# Altium schematic sheet Power.SchDoc: xcore.ai Multi Channel Audio
size 408 x 287 mm; DocumentNumber: 8; Revision: 1V1; SheetNumber: 8; SheetTotal: 8
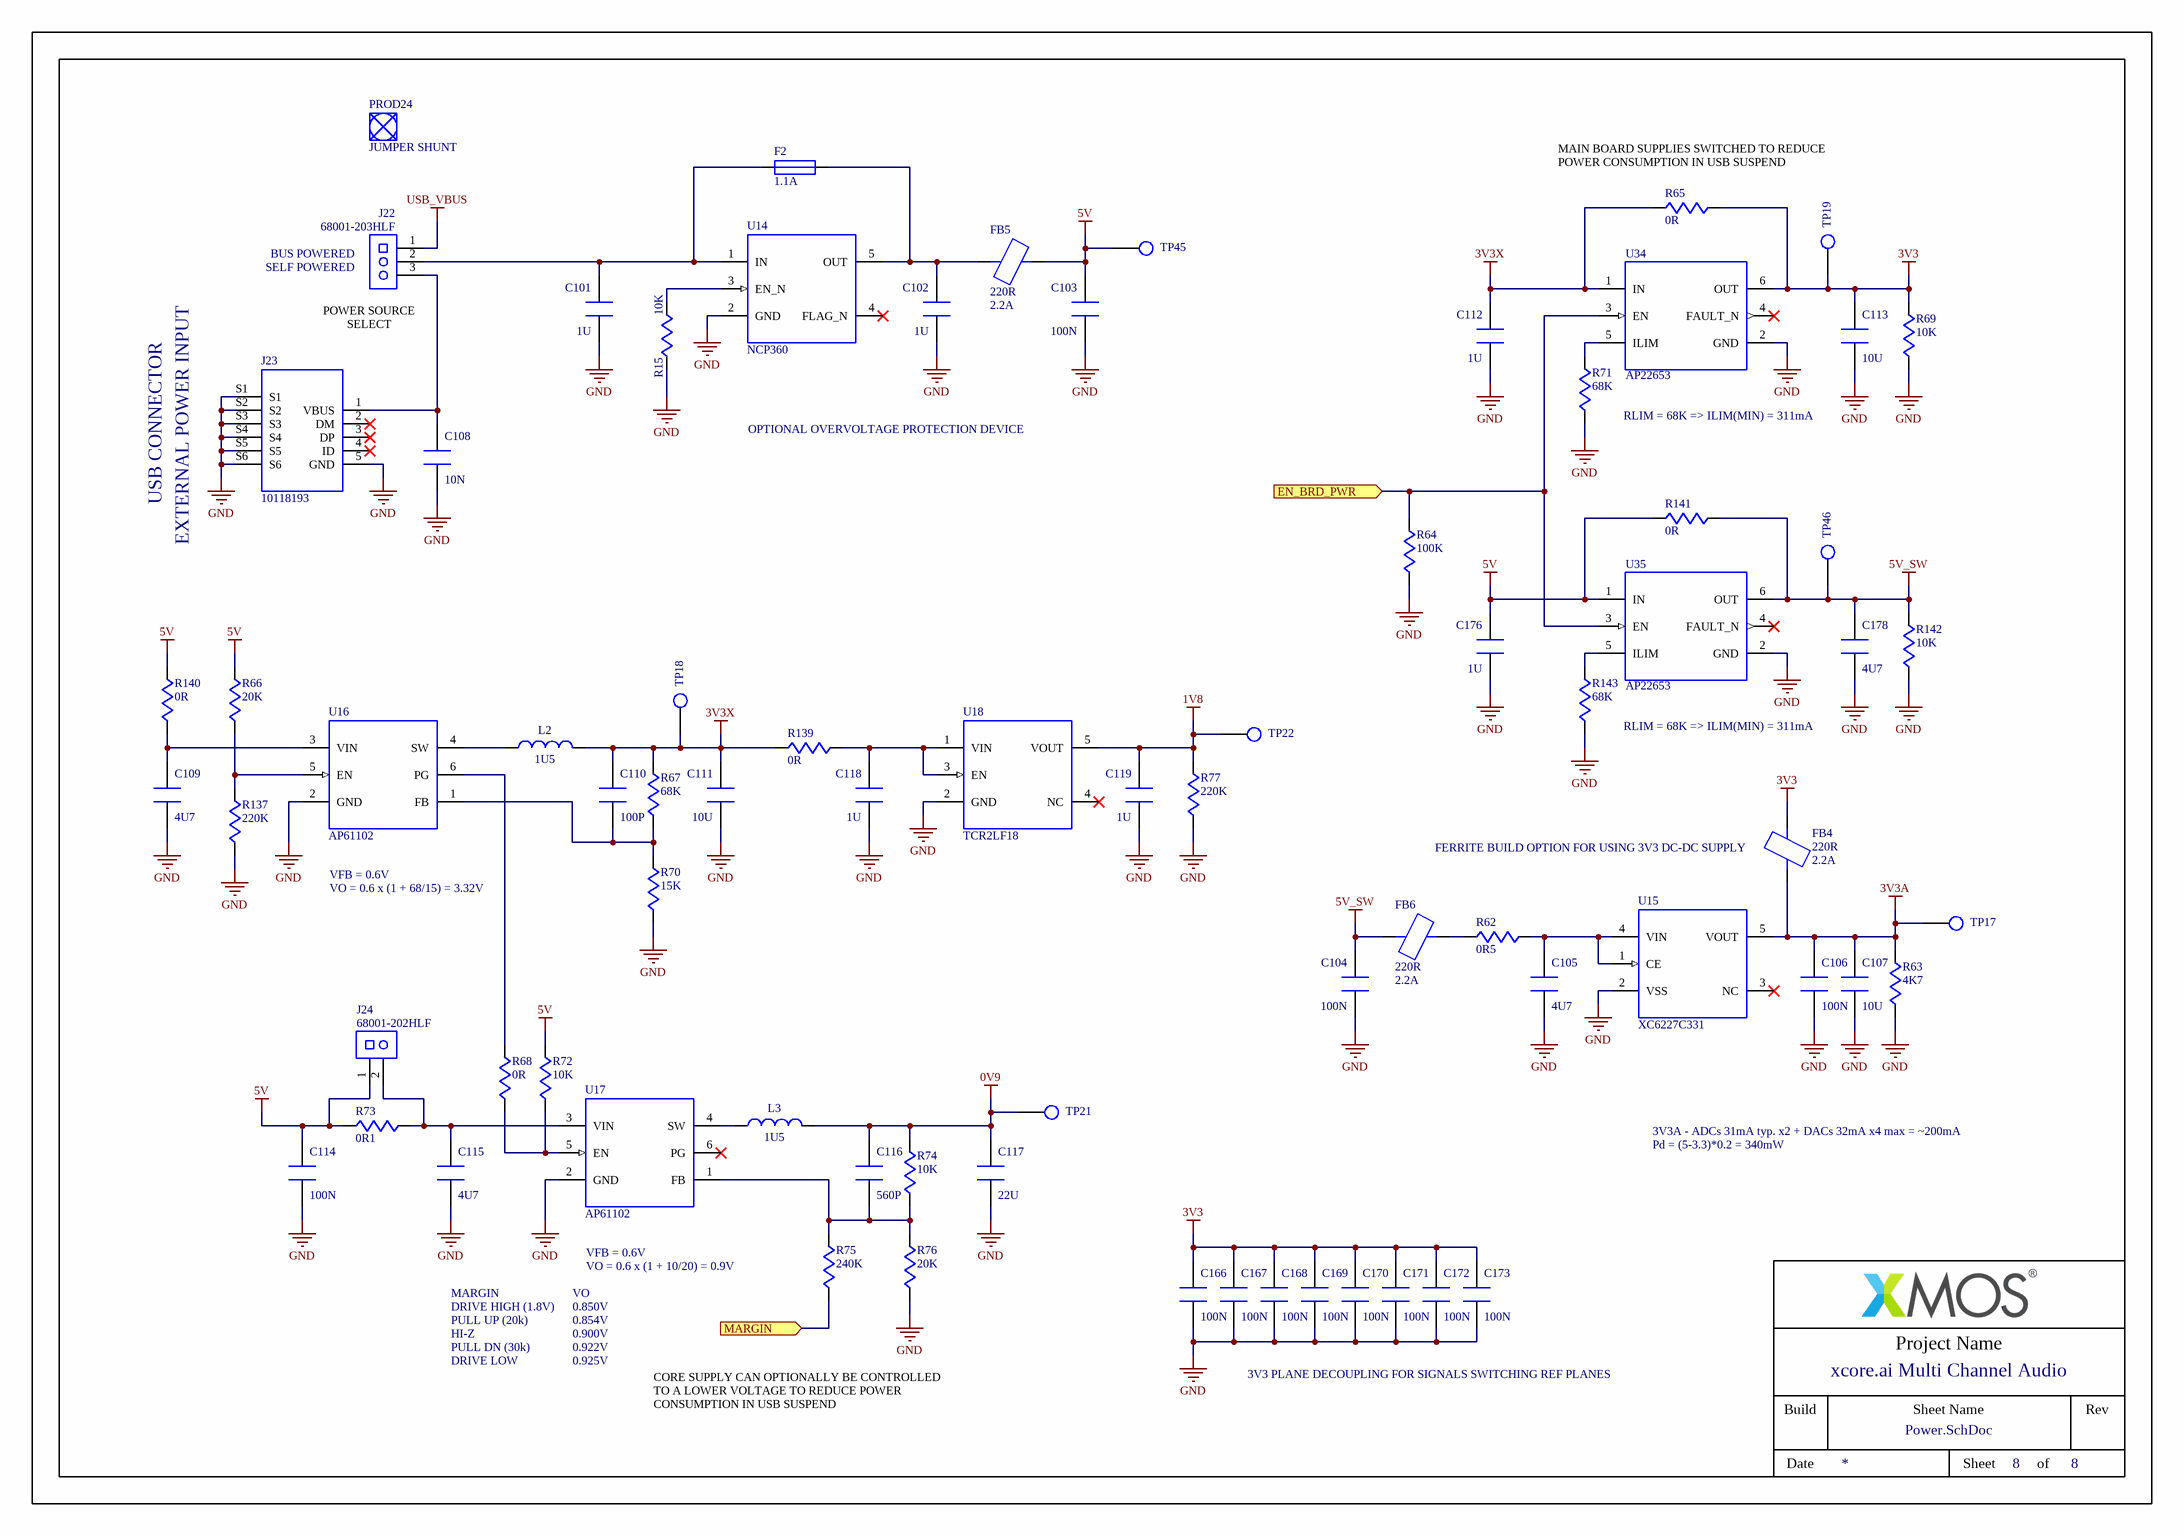
[diagram p0: Power.SchDoc]

## Parts
C101  1U  [CAPC1005X55N]
C102  1U  [CAPC1005X55N]
C103  100N  [CAPC1005X55N]
C104  100N  [CAPC1005X55N]
C105  4U7  [CAPC1608X90N]
C106  100N  [CAPC1005X55N]
C107  10U  [CAPC1608X90N]
C108  10N  [CAPC1005X55N]
C109  4U7  [CAPC1608X90N]
C110  100P  [CAPC1005X55N]
C111  10U  [CAPC1608X90N]
C112  1U  [CAPC1005X55N]
C113  10U  [CAPC1608X90N]
C114  100N  [CAPC1005X55N]
C115  4U7  [CAPC1608X90N]
C116  560P  [CAPC1005X55N]
C117  22U  [CAPC1608X90N]
C118  1U  [CAPC1005X55N]
C119  1U  [CAPC1005X55N]
C166  100N  [CAPC1005X55N]
C167  100N  [CAPC1005X55N]
C168  100N  [CAPC1005X55N]
C169  100N  [CAPC1005X55N]
C170  100N  [CAPC1005X55N]
C171  100N  [CAPC1005X55N]
C172  100N  [CAPC1005X55N]
C173  100N  [CAPC1005X55N]
C176  1U  [CAPC1005X55N]
C178  4U7  [CAPC1608X90N]
F2  1.1A  [FUSC4632X150N]
FB4  220R  Rated Current: 2.2A  [INDC1608X95N]
FB5  220R  Rated Current: 2.2A  [INDC1608X95N]
FB6  220R  Rated Current: 2.2A  [INDC1608X95N]
J22  68001-203HLF  [HDR_FCI_68001_203]
J23  10118193  [CON_FCI_10118193]
J24  68001-202HLF  [HDR_FCI_68001_202]
L2  1U5  [INDC2520X120N]
L3  1U5  [INDC2520X120N]
PROD24  JUMPER SHUNT  (mechanical)
R15  10K  [RESC1608X55N]
R62  0R5  [RESC1608X55N]
R63  4K7  [RESC1608X55N]
R64  100K  [RESC1608X55N]
R65  0R  [RESC1608X55N]
R66  20K  [RESC1608X55N]
R67  68K  [RESC1608X55N]
R68  0R  [RESC1608X55N]
R69  10K  [RESC1608X55N]
R70  15K  [RESC1608X55N]
R71  68K  [RESC1608X55N]
R72  10K  [RESC1608X55N]
R73  0R1  [RESC1608X55N]
R74  10K  [RESC1608X55N]
R75  240K  [RESC1608X55N]
R76  20K  [RESC1608X55N]
R77  220K  [RESC1608X55N]
R137  220K  [RESC1608X55N]
R139  0R  [RESC1608X55N]
R140  0R  [RESC1608X55N]
R141  0R  [RESC1608X55N]
R142  10K  [RESC1608X55N]
R143  68K  [RESC1608X55N]
TP17  TESTPOINT  [TESTPOINT_THRU]  (value not drawn)  (no BOM)
TP18  TESTPOINT  [TESTPOINT_THRU]  (value not drawn)  (no BOM)
TP19  TESTPOINT  [TESTPOINT_THRU]  (value not drawn)  (no BOM)
TP21  TESTPOINT  [TESTPOINT_THRU]  (value not drawn)  (no BOM)
TP22  TESTPOINT  [TESTPOINT_THRU]  (value not drawn)  (no BOM)
TP45  TESTPOINT  [TESTPOINT_THRU]  (value not drawn)  (no BOM)
TP46  TESTPOINT  [TESTPOINT_THRU]  (value not drawn)  (no BOM)
U14  NCP360  [SOT23-5P95_275X110L40X37N]
U15  XC6227C331  [TOREX_SOT_89_5]
U16  AP61102  [ICSOFL6P50_160X160X60L30X21N]
U17  AP61102  [ICSOFL6P50_160X160X60L30X21N]
U18  TCR2LF18  [SOT23-5P95_275X110L40X37N]
U34  AP22653  [SOT95P280X145-6N]
U35  AP22653  [SOT95P280X145-6N]

## Ports
EN_BRD_PWR (in), MARGIN (in)

## Nets
0V9: C116.1 C117.1 L3.2 R74.2 TP21.1
1V8: C119.1 R77.2 TP22.1 U18.5(VOUT)
3V3: C113.1 C166.1 C167.1 C168.1 C169.1 C170.1 C171.1 C172.1 C173.1 FB4.2 R65.2 R69.2 TP19.1 U34.6(OUT)
3V3A: C106.1 C107.1 FB4.1 R63.2 TP17.1 U15.5(VOUT)
3V3X: C110.1 C111.1 C112.1 L2.2 R65.1 R67.2 R139.1 TP18.1 U34.1(IN)
5V: C103.1 C114.1 C176.1 FB5.2 J24.1 R66.2 R72.2 R73.1 R140.2 R141.1 TP45.1 U35.1(IN)
5V_SW: C104.1 C178.1 FB6.1 R141.2 R142.2 TP46.1 U35.6(OUT)
GND: C101.2 C102.2 C103.2 C104.2 C105.2 C106.2 C107.2 C108.2 C109.2 C111.2 C112.2 C113.2 C114.2 C115.2 C117.2 C118.2 C119.2 C166.2 C167.2 C168.2 C169.2 C170.2 C171.2 C172.2 C173.2 C176.2 C178.2 J23.5(GND) J23.S1 J23.S2 J23.S3 J23.S4 J23.S5 J23.S6 R15.1 R63.1 R64.1 R69.1 R70.1 R71.1 R76.1 R77.1 R137.1 R142.1 R143.1 U14.2(GND) U15.2(VSS) U16.2(GND) U17.2(GND) U18.2(GND) U34.2(GND) U35.2(GND)
USB_VBUS: J22.1
EN_BRD_PWR: R64.2 U34.3(EN) U35.3(EN) ; port EN_BRD_PWR
MARGIN: R75.1 ; port MARGIN
NetC101_1: C101.1 F2.1(T1) J22.2 U14.1(IN)
NetC102_1: C102.1 F2.2(T2) FB5.1 U14.5(OUT)
NetC105_1: C105.1 R62.2 U15.1(CE) U15.4(VIN)
NetC108_1: C108.1 J22.3 J23.1(VBUS)
NetC109_1: C109.1 R140.1 U16.3(VIN)
NetC110_2: C110.2 R67.1 R70.2 U16.1(FB)
NetC115_1: C115.1 J24.2 R73.2 U17.3(VIN)
NetC116_2: C116.2 R74.1 R75.2 R76.2 U17.1(FB)
NetC118_1: C118.1 R139.2 U18.1(VIN) U18.3(EN)
NetFB6_2: FB6.2 R62.1
NetL2_1: L2.1 U16.4(SW)
NetL3_1: L3.1 U17.4(SW)
NetR15_2: R15.2 U14.3(EN_N)
NetR66_1: R66.1 R137.2 U16.5(EN)
NetR68_1: R68.1 R72.1 U17.5(EN)
NetR68_2: R68.2 U16.6(PG)
NetR71_2: R71.2 U34.5(ILIM)
NetR143_2: R143.2 U35.5(ILIM)

Not connected (* = marked no-connect by the designer): J23 2(DM)* 3(DP)* 4(ID)*; U14 4(FLAG_N)*; U15 3(NC)*; U17 6(PG)*; U18 4(NC)*; U34 4(FAULT_N)*; U35 4(FAULT_N)*

## Notes on the sheet
- (near R65) MAIN BOARD SUPPLIES SWITCHED TO REDUCE POWER CONSUMPTION IN USB SUSPEND
- (near J22) BUS POWERED
- (near J22) SELF POWERED
- (near J22) POWER SOURCE
  SELECT
- OPTIONAL OVERVOLTAGE PROTECTION DEVICE
- (near R71) Text
- (near R71) RLIM = 68K => ILIM(MIN) = 311mA
- USB CONNECTOR
- EXTERNAL POWER INPUT
- (near R143) RLIM = 68K => ILIM(MIN) = 311mA
- VFB = 0.6V
- (near FB4) FERRITE BUILD OPTION FOR USING 3V3 DC-DC SUPPLY
- VO = 0.6 x (1 + 68/15) = 3.32V
- 3V3A - ADCs 31mA typ. x2 + DACs 32mA x4 max = ~200mA
- Pd = (5-3.3)*0.2 = 340mW
- VO = 0.6 x (1 + 10/20) = 0.9V
- MARGIN
- HI-Z
- PULL DN (30k)
- PULL UP (20k)
- DRIVE HIGH (1.8V)
- VO
- 0.900V
- 0.922V
- 0.854V
- 0.850V
- DRIVE LOW
- 0.925V
- CORE SUPPLY CAN OPTIONALLY BE CONTROLLED TO A LOWER VOLTAGE TO REDUCE POWER CONSUMPTION IN USB SUSPEND
- 3V3 PLANE DECOUPLING FOR SIGNALS SWITCHING REF PLANES
- Project Name
- Build
- Sheet Name
- Rev
- Date
- Sheet
- of

## Library data of the parts
C101 C102 C112 C118 C119 C176 = STD-06-0140: CHIP CAPACITOR, CERAMIC, 1.0UF, 16V, 10%, X5R, 0402; Manufacturer: Murata; Manufacturer Part Number: GRM155R61C105MA12D; Tolerance: 20%; Approx Volume Cost ($): 0.011; VALUE: 1U; Part Number: STD-06-0140; Dielectric: X5R; Rated Voltage: 16V; Web Search Link: http://www.google.com/search?q=GRM155R61C105MA12D
C103 C104 C106 C114 C166-C173 = STD-06-0048: CHIP CAPACITOR, CERAMIC, 100NF, 16V, 10%, X7R, 0402; Manufacturer: Yageo; Manufacturer Part Number: CC0402KRX7R7BB104; Approx Volume Cost ($): 0.003; VALUE: 100N; Part Number: STD-06-0048; Dielectric: X7R; Rated Voltage: 16V; Tolerance: 10%; Web Search Link: http://www.google.com/search?q=CC0402KRX7R7BB104
C105 C109 C115 C178 = STD-06-0151: CHIP CAPACITOR, CERAMIC, 4.7UF, 16V, 10%, X5R, 0603; Manufacturer: Murata; Manufacturer Part Number: GRM188R61C475KE11D; Approx Volume Cost ($): 0.084; VALUE: 4U7; Part Number: STD-06-0151; Dielectric: X5R; Rated Voltage: 16V; Tolerance: 10%; Web Search Link: http://www.google.com/search?q=GRM188R61C475KE11D
C107 C111 C113 = GEN-03-0043: CHIP CAPACITOR, CERAMIC, 10UF, 10V, 20%, X5R, 0603; Manufacturer: Murata; Manufacturer Part Number: GRM188R61A106ME69; Approx Volume Cost ($): 0.03; VALUE: 10U; Part Number: GEN-03-0043; Dielectric: X5R; Rated Voltage: 10V; Tolerance: 20%; Web Search Link: http://www.google.com/search?q=GRM188R61A106ME69
C108 = STD-06-0042: CHIP CAPACITOR, CERAMIC, 10NF, 50V, 10%, X7R, 0402; Manufacturer: Yageo; Manufacturer Part Number: CC0402KRX7R9BB103; Approx Volume Cost ($): 0.002; VALUE: 10N; Part Number: STD-06-0042; Dielectric: X7R; Rated Voltage: 50V; Tolerance: 10%; Web Search Link: http://www.google.com/search?q=CC0402KRX7R9BB103
C110 = STD-06-0030: CHIP CAPACITOR, CERAMIC, 100PF, 50V, 10%, X7R, 0402; Manufacturer: Yageo; Manufacturer Part Number: CC0402KRX7R9BB101; Approx Volume Cost ($): 0.002; VALUE: 100P; Part Number: STD-06-0030; Dielectric: X7R; Rated Voltage: 50V; Tolerance: 10%; Web Search Link: http://www.google.com/search?q=CC0402KRX7R9BB101
C116 = STD-06-0147: CHIP CAPACITOR, CERAMIC, 560PF, 50V, 5%, NP0, 0402; Manufacturer: Yageo; Manufacturer Part Number: CC0402JRNPO9BN561; Approx Volume Cost ($): 0.017; VALUE: 560P; Part Number: STD-06-0147; Dielectric: NP0; Rated Voltage: 50V; Tolerance: 5%; Web Search Link: http://www.google.com/search?q=CC0402JRNPO9BN561
C117 = GEN-03-0046: CHIP CAPACITOR, CERAMIC, 22UF, 6.3V, 20%, X5R, 0603; Manufacturer: Murata; Manufacturer Part Number: GRM188R60J226MEA0; Approx Volume Cost ($): 0.04; VALUE: 22U; Part Number: GEN-03-0046; Dielectric: X5R; Rated Voltage: 6.3V; Tolerance: 20%; Web Search Link: http://www.google.com/search?q=GRM188R60J226MEA0
F2 = GEN-21-0008: Polyswitch Resettable Fuse, miniSMDC Series, 1.1A, 24V, SMD; Manufacturer: Littelfuse; Manufacturer Part Number: MINISMDC110F/24; Max Resistance (R1max): 0.18R; Approx Volume Cost ($): 0.25; VALUE: 1.1A; Part Number: GEN-21-0008; Max Voltage: 24V; Web Search Link: http://www.google.com/search?q=MINISMDC110F/24
FB4-FB6 = GEN-04-0018: Ferrite Bead, 220R AT 100MHz, For Power Lines, AEC-Q200, 0603, 2.2A; Manufacturer: Murata; Manufacturer Part Number: BLM18KG221BH1; Max DCR: 0.05R; Approx Volume Cost ($): 0.022; VALUE: 220R; Part Number: GEN-04-0018; Web Search Link: http://www.google.com/search?q=BLM18KG221BH1
J22 = GEN-01-0023: Pin Header, Male, Vertical, Through Hole, 3 Way, 1x3, 0.1 Inch Pitch; Manufacturer: FCI; Approx Volume Cost ($): 0.08; VALUE: 68001-203HLF; Part Number: GEN-01-0023; Manufacturer Part Number: 68001-203HLF; Web Search Link: http://www.google.com/search?q=68001-203HLF
J23 = GEN-01-0020: USB Micro B Receptacle, Right Angle, SMD w/2 DIP Legs; Manufacturer: FCI; Manufacturer Part Number: 10118193-0001LF; Approx Volume Cost ($): 0.19; VALUE: 10118193; Part Number: GEN-01-0020; Web Search Link: http://www.google.com/search?q=10118193-0001LF
J24 = GEN-01-0011: Pin Header, Male, Vertical, Through Hole, 2 Way, 1x2, 0.1 Inch Pitch; Manufacturer: FCI; Approx Volume Cost ($): 0.08; VALUE: 68001-202HLF; Part Number: GEN-01-0011; Manufacturer Part Number: 68001-202HLF; Web Search Link: http://www.google.com/search?q=68001-202HLF
L2 L3 = GEN-05-0025: Power Inductor, 1.5uH, 2.6A, 65mR DCR, 2.5x2.0x1.2mm, SMD; Manufacturer: Taiyo Yuden; Manufacturer Part Number: MAMK2520H1R5M; Tolerance: 20%; Max DC Resistance: 0.065R; Rated Current (Saturation): 3.3A; Approx Volume Cost ($): 0.096; VALUE: 1U5; Part Number: GEN-05-0025; Rated Current (Temp Rise): 2.6A; Web Search Link: http://www.google.com/search?q=MAMK2520H1R5M
PROD24 = GEN-23-0011: Jumper Shunt, Single Circuit, Open Type, 2.54mm Pitch, 6mm High, Gold Flash; Manufacturer: Sullins; Manufacturer Part Number: QPC02SXGN-RC; Approx Volume Cost ($): 0.03; VALUE: JUMPER SHUNT; Part Number: GEN-23-0011; Web Search Link: http://www.google.com/search?q=QPC02SXGN-RC
R15 R69 R72 R74 R142 = STD-02-0086: CHIP RESISTOR, 10K OHM, 0.1W, 1%, 0603; Manufacturer: Yageo; Manufacturer Part Number: RC0603FR-0710KL; Max Voltage: 50V; Max Power: 100mW; Temperature Coefficient: ±100ppm/°C; Approx Volume Cost ($): 0.002; VALUE: 10K; Part Number: STD-02-0086; Tolerance: 1%; Web Search Link: http://www.google.com/search?q=RC0603FR-0710KL
R62 = GEN-02-0023: CHIP RESISTOR, 0.5 OHM, 100mW, 1%, 0603; Manufacturer: Yageo; Manufacturer Part Number: RL0603FR-070R5L; Max Voltage: 50V; Max Power: 0.1W; Temperature Coefficient: ±800ppm/°C; Approx Volume Cost ($): 0.06; VALUE: 0R5; Part Number: GEN-02-0023; Tolerance: 1%; Web Search Link: http://www.google.com/search?q=RL0603FR-070R5L
R63 = STD-02-0078: CHIP RESISTOR, 4.7K OHM, 0.1W, 1%, 0603; Manufacturer: Yageo; Manufacturer Part Number: RC0603FR-074K7L; Max Voltage: 50V; Max Power: 100mW; Temperature Coefficient: ±100ppm/°C; Approx Volume Cost ($): 0.002; VALUE: 4K7; Part Number: STD-02-0078; Tolerance: 1%; Web Search Link: http://www.google.com/search?q=RC0603FR-074K7L
R64 = STD-02-0110: CHIP RESISTOR, 100K OHM, 0.1W, 1%, 0603; Manufacturer: Yageo; Manufacturer Part Number: RC0603FR-07100KL; Max Voltage: 50V; Max Power: 100mW; Temperature Coefficient: ±100ppm/°C; Approx Volume Cost ($): 0.002; VALUE: 100K; Part Number: STD-02-0110; Tolerance: 1%; Web Search Link: http://www.google.com/search?q=RC0603FR-07100KL
R65 R68 R139-R141 = STD-02-0001: CHIP RESISTOR, ZERO OHM JUMPER, 1A, 0603; Manufacturer: Yageo; Manufacturer Part Number: RC0603JR-070RL; Tolerance: NA; Max Voltage: 50V; Approx Volume Cost ($): 0.002; VALUE: 0R; Part Number: STD-02-0001; Max Power: NA; Temperature Coefficient: NA; Web Search Link: http://www.google.com/search?q=RC0603JR-070RL
R66 R76 = STD-02-0093: CHIP RESISTOR, 20K OHM, 0.1W, 1%, 0603; Manufacturer: Yageo; Manufacturer Part Number: RC0603FR-0720KL; Max Voltage: 50V; Max Power: 100mW; Temperature Coefficient: ±100ppm/°C; Approx Volume Cost ($): 0.002; VALUE: 20K; Part Number: STD-02-0093; Tolerance: 1%; Web Search Link: http://www.google.com/search?q=RC0603FR-0720KL
R67 R71 R143 = STD-02-0106: CHIP RESISTOR, 68K OHM, 0.1W, 1%, 0603; Manufacturer: Yageo; Manufacturer Part Number: RC0603FR-0768KL; Max Voltage: 50V; Max Power: 100mW; Temperature Coefficient: ±100ppm/°C; Approx Volume Cost ($): 0.002; VALUE: 68K; Part Number: STD-02-0106; Tolerance: 1%; Web Search Link: http://www.google.com/search?q=RC0603FR-0768KL
R70 = STD-02-0090: CHIP RESISTOR, 15K OHM, 0.1W, 1%, 0603; Manufacturer: Yageo; Manufacturer Part Number: RC0603FR-0715KL; Max Voltage: 50V; Max Power: 100mW; Temperature Coefficient: ±100ppm/°C; Approx Volume Cost ($): 0.002; VALUE: 15K; Part Number: STD-02-0090; Tolerance: 1%; Web Search Link: http://www.google.com/search?q=RC0603FR-0715KL
R73 = GEN-02-0024: CHIP RESISTOR, 0.1 OHM, 100mW, 1%, 0603; Manufacturer: Yageo; Manufacturer Part Number: RL0603FR-070R1L; Max Voltage: 50V; Max Power: 0.1W; Temperature Coefficient: ±800ppm/°C; Approx Volume Cost ($): 0.06; VALUE: 0R1; Part Number: GEN-02-0024; Tolerance: 1%; Web Search Link: http://www.google.com/search?q=RL0603FR-070R1L
R75 = STD-02-0119: CHIP RESISTOR, 240K OHM, 0.1W, 1%, 0603; Manufacturer: Yageo; Manufacturer Part Number: RC0603FR-07240KL; Max Voltage: 50V; Max Power: 100mW; Temperature Coefficient: ±100ppm/°C; Approx Volume Cost ($): 0.002; VALUE: 240K; Part Number: STD-02-0119; Tolerance: 1%; Web Search Link: http://www.google.com/search?q=RC0603FR-07240KL
R77 R137 = STD-02-0118: CHIP RESISTOR, 220K OHM, 0.1W, 1%, 0603; Manufacturer: Yageo; Manufacturer Part Number: RC0603FR-07220KL; Max Voltage: 50V; Max Power: 100mW; Temperature Coefficient: ±100ppm/°C; Approx Volume Cost ($): 0.002; VALUE: 220K; Part Number: STD-02-0118; Tolerance: 1%; Web Search Link: http://www.google.com/search?q=RC0603FR-07220KL
TP17-TP19 TP21 TP22 TP45 TP46 = GEN-24-0002: Testpoint, Through Hole; Manufacturer: NA; VALUE: TESTPOINT; Part Number: GEN-24-0002; Manufacturer Part Number: NA; Approx Volume Cost ($): NA
U14 = GEN-14-0068: USB Positive Overvoltage Protection Controller, Internal P-FET, OVLO 6.25V, TSOT23-5; Manufacturer: ON Semiconductor; Manufacturer Part Number: NCP360SNAET1G; Op Temp Range: TA = -40 to 85; Approx Volume Cost ($): 0.25; VALUE: NCP360; Part Number: GEN-14-0068; Web Search Link: http://www.google.com/search?q=NCP360SNAET1G
U15 = GEN-14-0070: Voltage Regulator, Linear, Fixed, 3V3, 700mA, w/enable, SOT89-5; Manufacturer: Torex Semiconductor; Manufacturer Part Number: XC6227C331PR-G; Op Temp Range: TA = -40 to 85; Approx Volume Cost ($): 0.35; VALUE: XC6227C331; Part Number: GEN-14-0070; Web Search Link: http://www.google.com/search?q=XC6227C331PR-G
U16 U17 = GEN-14-0064: DC-DC Synchronous Buck Converter, Adjustable, PFM/PWM, Power Good, 2.2MHz, 1A, SOT563; Manufacturer: Diodes Incorporated; Manufacturer Part Number: AP61102Z6-7; Op Temp Range: TJ = -40 to 125; Approx Volume Cost ($): 0.11; VALUE: AP61102; Part Number: GEN-14-0064; Web Search Link: http://www.google.com/search?q=AP61102Z6-7
U18 = GEN-14-0066: Voltage Regulator, Linear, Fixed, 1V8, 200mA, Low Iq=2uA, Output Active Discharge, TSOT23-5; Manufacturer: Toshiba; Manufacturer Part Number: TCR2LF18,LM; Approx Volume Cost ($): 0.08; VALUE: TCR2LF18; Part Number: GEN-14-0066; Web Search Link: http://www.google.com/search?q=TCR2LF18,LM
U34 U35 = GEN-14-0072: Precision Adjustable Current Limited Load Switch, 3.0 - 5.5V, 2.1A max, Active High Enable, SOT26; Manufacturer: Diodes Incorporated; Manufacturer Part Number: AP22653W6-7; Op Temp Range: TA = -40 to 85; Approx Volume Cost ($): 0.18; VALUE: AP22653; Part Number: GEN-14-0072; Web Search Link: http://www.google.com/search?q=AP22653W6-7